# Altium schematic sheet Potentiometer.SchDoc
size A4
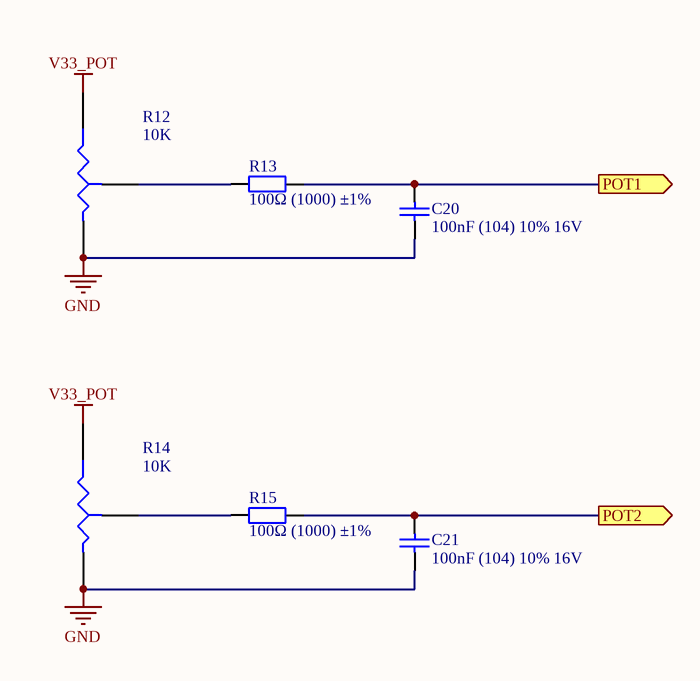
[diagram p0: Potentiometer.SchDoc]

## Parts
C20  100nF (104) 10% 16V  [0402_C]
C21  100nF (104) 10% 16V  [0402_C]
R12  10K  [AIN16]
R13  100Ω (1000) ±1%  [0402_R]
R14  10K  [AIN16]
R15  100Ω (1000) ±1%  [0402_R]

## Ports
POT1 (out), POT2 (out)

## Nets
GND: C20.1 C21.1 R12.1(A) R14.1(A)
V33_POT: R12.2(B) R14.2(B)
POT1: C20.2 R13.2 ; port POT1
POT2: C21.2 R15.2 ; port POT2
NetR12_3: R12.3(TAP) R13.1
NetR14_3: R14.3(TAP) R15.1

## Library data of the parts
C20 C21 = 0402 100nF (104) 10% 16V: 贴片电容; ComponentLink1Description: 供应商链接; ComponentLink1URL: http://www.szlcsc.com/product/details_1877.html; Package: 0402; Supplier: LC; SuppliersPartNumber: C1525
R12 R14 = Res Tap: Tapped Resistor; Sim Note: Enter the Resistance value and the set point into parameter fields.; Set Position: 0.5; Value: 1K; Published: 24-Mar-1999; LatestRevisionDate: 17-Jul-2002; LatestRevisionNote: Re-released for DXP Platform.; PackageReference: VR3; Publisher: Altium Limited; PackageDescription: Variable Resistor, Thru-Hole; 3 Leads
R13 R15 = 0402 100Ω (1000) 1%: 贴片电阻; ComponentLink1Description: 供应商链接; ComponentLink1URL: http://www.szlcsc.com/product/details_25819.html; Package: 0402; Supplier: LC; SuppliersPartNumber: C25076